# EAGLE design largemoteino1.1 (EAGLE 7.5.0)
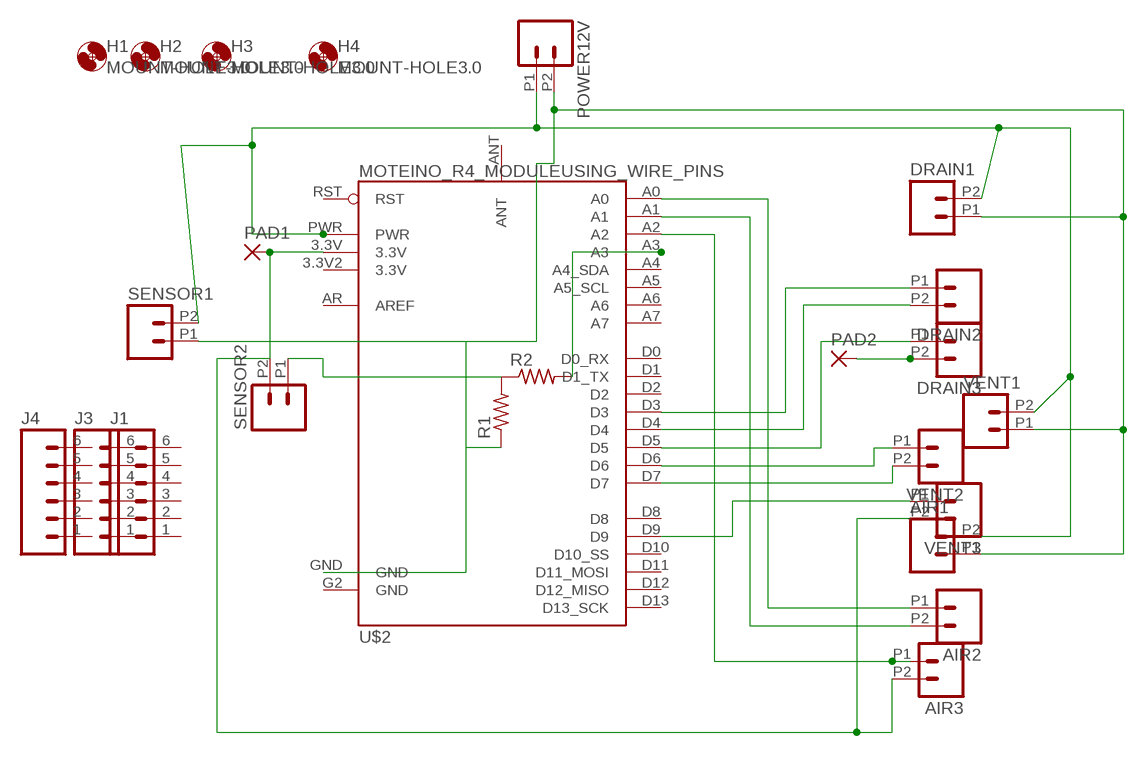
[diagram p0: schematic, sheet 1]

## Parts
AIR1  M022.54MM_SCREWTERM  [1X02_2.54_SCREWTERM]
AIR2  M022.54MM_SCREWTERM  [1X02_2.54_SCREWTERM]
AIR3  M022.54MM_SCREWTERM  [1X02_2.54_SCREWTERM]
DRAIN1  M022.54MM_SCREWTERM  [1X02_2.54_SCREWTERM]
DRAIN2  M022.54MM_SCREWTERM  [1X02_2.54_SCREWTERM]
DRAIN3  M022.54MM_SCREWTERM  [1X02_2.54_SCREWTERM]
H1  MOUNT-HOLE3.0  [3,0]
H2  MOUNT-HOLE3.0  [3,0]
H3  MOUNT-HOLE3.0  [3,0]
H4  MOUNT-HOLE3.0  [3,0]
J1  M06LOCK_LONGPADS  [1X06_LOCK_LONGPADS]
J3  M06LOCK_LONGPADS  [1X06_LOCK_LONGPADS]
J4  M06LOCK_LONGPADS  [1X06_LOCK_LONGPADS]
PAD1  2,15/1,0  [2,15/1,0]
PAD2  2,15/1,0  [2,15/1,0]
POWER12V  M022.54MM_SCREWTERM  [1X02_2.54_SCREWTERM]
R1  R-US_0207/10  [0207/10]
R2  R-US_0207/10  [0207/10]
SENSOR1  M022.54MM_SCREWTERM  [1X02_2.54_SCREWTERM]
SENSOR2  M022.54MM_SCREWTERM  [1X02_2.54_SCREWTERM]
U$2  MOTEINO_R4_MODULEUSING_WIRE_PINS  [MOTEINO_R4_WIRE]
VENT1  M022.54MM_SCREWTERM  [1X02_2.54_SCREWTERM]
VENT2  M022.54MM_SCREWTERM  [1X02_2.54_SCREWTERM]
VENT3  M022.54MM_SCREWTERM  [1X02_2.54_SCREWTERM]

## Nets
GND: AIR1.P1 DRAIN1.P1 POWER12V.P2 R1.1 SENSOR1.P1 U$2.GND VENT1.P1
N$1: AIR1.P2 DRAIN1.P2 POWER12V.P1 SENSOR1.P2 U$2.PWR VENT1.P2
N$2: DRAIN2.P1 U$2.D3
N$3: DRAIN2.P2 U$2.D4
N$4: DRAIN3.P1 U$2.D5
N$5: U$2.D6 VENT2.P1
N$6: R1.2 R2.1 SENSOR2.P1
N$7: U$2.D7 VENT2.P2
N$8: U$2.D9 VENT3.P1
N$9: AIR2.P1 U$2.A0
N$10: AIR2.P2 U$2.A1
N$11: AIR3.P1 U$2.A2
N$12: DRAIN3.P2 PAD2.1(P)
N$13: AIR3.P2 PAD1.1(P) SENSOR2.P2 U$2.3.3V VENT3.P2
N$15: R2.2 U$2.A3
Unconnected: J1.1 J1.2 J1.3 J1.4 J1.5 J1.6 J3.1 J3.2 J3.3 J3.4 J3.5 J3.6 J4.1 J4.2 J4.3 J4.4 J4.5 J4.6 U$2.3.3V2(3.3V) U$2.A4(A4_SDA) U$2.A5(A5_SCL) U$2.A6 U$2.A7 U$2.ANT U$2.AR(AREF) U$2.D0(D0_RX) U$2.D1(D1_TX) U$2.D2 U$2.D8 U$2.D10(D10_SS) U$2.D11(D11_MOSI) U$2.D12(D12_MISO) U$2.D13(D13_SCK) U$2.RST

## Power pins joined to a net without a drawn wire
GND: U$2.G2(GND)

## Library data of the parts
AIR1-AIR3 DRAIN1-DRAIN3 POWER12V SENSOR1 SENSOR2 VENT1-VENT3 = SparkFun-Connectors:M02: Standard 2-pin 0.1" header. Use with - straight break away headers ( PRT-00116) - right angle break away headers (PRT-00553) - swiss pins (PRT-00743) - machine pins (PRT-00117) - female headers (PRT-00115) Molex polarized connector foot print use with: PRT-08233 with associated crimp pins and housings. 2.54_SCREWTERM for use with PRT-10571. 3.5mm Screw Terminal footprints for PRT-08084 5mm Screw Terminal footprints for use with PRT-08432
H1-H4 = holes:MOUNT-HOLE: MOUNTING HOLE with drill center marker
J1 J3 J4 = SparkFun-Connectors:M06: Header 6 Standard 6-pin 0.1" header. Use with straight break away headers (SKU : PRT-00116), right angle break away headers (PRT-00553), swiss pins (PRT-00743), machine pins (PRT-00117), and female headers (PRT-00115). Molex polarized connector foot print use with SKU : PRT-08094 with associated crimp pins and housings. NOTES ON THE VARIANTS LOCK and LOCK_LONGPADS... This footprint was designed to help hold the alignment of a through-hole component (i.e. 6-pin header) while soldering it into place. You may notice that each hole has been shifted either up or down by 0.005 of an inch from it's more standard position (which is a perfectly straight line). This slight alteration caused the pins (the squares in the middle) to touch the edges of the holes. Because they are alternating, it causes a "brace" to hold the component in place. 0.005 has proven to be the perfect amount of "off-center" position when using our standard breakaway headers. Although looks a little odd when you look at the bare footprint, once you have a header in there, the alteration is very hard to notice. Also,if you push a header all the way into place, it is covered up entirely on the bottom side. This idea of altering the position of holes to aid alignment will be further integrated into the Sparkfun Library for other footprints. It can help hold any component with 3 or more connection pins.
PAD1 PAD2 = wirepad:2,15/1,0: THROUGH-HOLE PAD
R1 R2 = resistor:R-US_: RESISTOR, American symbol
U$2 = MoteinoR4Mod:MOTEINO_R4_MODULE: Moteino Module as a device. Available in two footprints, one with pads for 0.025" sq pins, and one using wire pins.

## Board
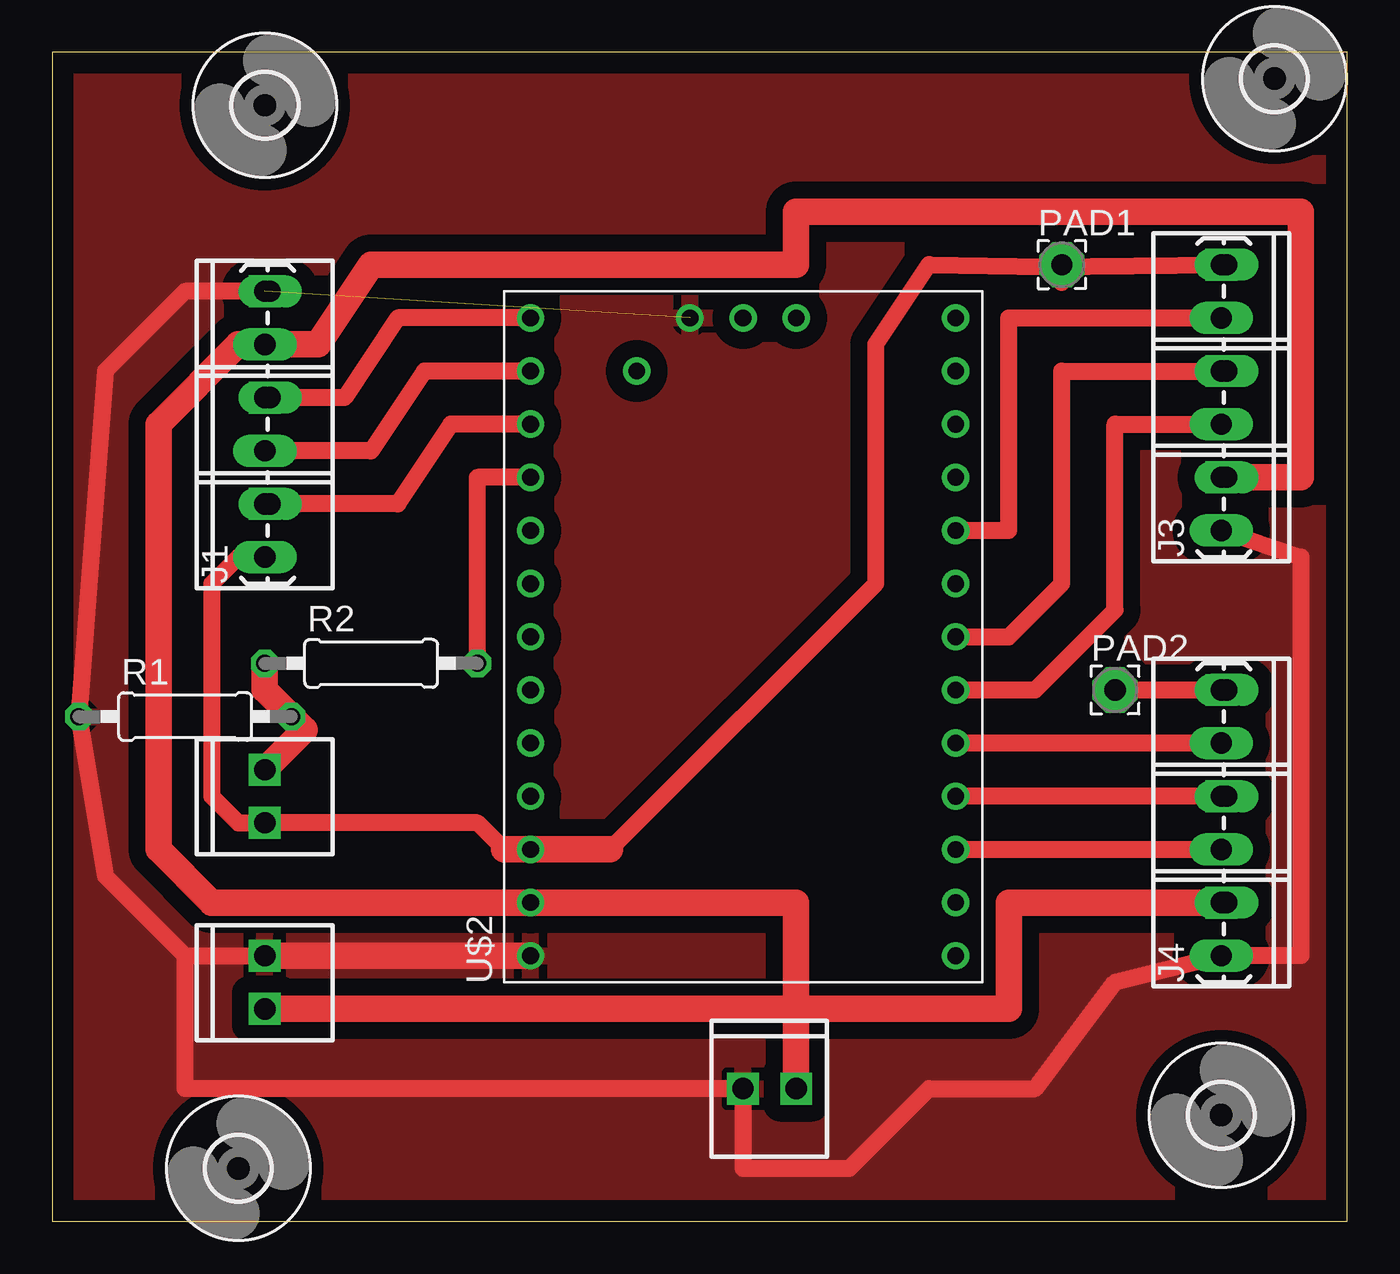
[diagram p1: board, top side]

Size 61.9 x 55.87 mm. Coordinates in mm from the lower left corner, seen from the top.
Outline: 0,0 61.9,0 61.9,55.87 0,55.87 0,0
Copper layers (1*16): Top 0.035mm / dielectric 1.5mm / Bottom 0.035mm
Design rules "default *": minimum track width 10mil, minimum drill 24mil, track to track 32mil, track to pad 32mil, pad to pad 32mil, via to via 32mil, smd to smd 8mil, copper to edge 40mil, drill to drill 8mil, minimum pad ring 10mil, minimum via ring 8mil, stop-mask expansion 4mil, vias tented up to drill 0mil, thermal gap 10mil

### Footprints (pad centres in the part's own frame; a part is rotated, then mirrored left to right if it is on the bottom)
1X02_2.54_SCREWTERM = drill 1.016 square: P1 2.54,0; P2 0,0
3,0 = hole 3: 0,0
1X06_LOCK_LONGPADS = drill 1.016 long: 1 0,0; 2 2.54,-0.254; 3 5.08,0; 4 7.62,-0.254; 5 10.16,0; 6 12.7,-0.254
2,15/1,0 = drill 1.016 pad 2.159 octagon: 1 0,0
0207/10 = drill 0.813 octagon: 1 -5.08,0; 2 5.08,0
MOTEINO_R4_WIRE = drill 0.8: 3.3V -10.16,8.89; 3.3V2 15.24,-1.27; A0 15.24,8.89; A1 12.7,8.89; A2 10.16,8.89; A3 7.62,8.89; A4 5.08,8.89; A5 2.54,8.89; A6 0,8.89; A7 -2.54,8.89; ANT 12.7,3.81; AR 15.24,-3.81; D0 -5.08,8.89; D1 -7.62,8.89; D2 -12.7,-11.43; D3 -10.16,-11.43; D4 -7.62,-11.43; D5 -5.08,-11.43; D6 -2.54,-11.43; D7 0,-11.43; D8 2.54,-11.43; D9 5.08,-11.43; D10 7.62,-11.43; D11 10.16,-11.43; D12 12.7,-11.43; D13 15.24,-11.43; G2 15.24,1.27; GND -15.24,8.89; PWR -12.7,8.89; RST -15.24,-11.43

### Placement (x,y rotation side)
AIR1  10.16,41.91 90 top
AIR2  10.16,36.83 90 top
AIR3  10.16,31.75 90 top
DRAIN1  55.88,15.24 270 top
DRAIN2  55.88,20.32 270 top
DRAIN3  55.88,25.4 270 top
H1  8.89,2.54 0 top
H2  55.88,5.08 0 top
H3  58.42,54.61 0 top
H4  10.16,53.34 0 top
J1  10.16,31.75 90 top
J3  55.88,33.02 90 top
J4  55.88,12.7 90 top
PAD1  48.26,45.72 0 top
PAD2  50.8,25.4 0 top
POWER12V  33.02,6.35 0 top
R1  6.35,24.13 0 top
R2  15.24,26.67 0 top
SENSOR1  10.16,10.16 90 top
SENSOR2  10.16,19.05 90 top
U$2  31.75,27.94 90 top
VENT1  55.88,35.56 270 top
VENT2  55.88,40.64 270 top
VENT3  55.88,45.72 270 top

### Tracks (layer width: path | path; a pad name or v marks a point on that pad's centre or on a via)
GND  (1 unrouted)
  Top 0.813: 6.35,12.7 6.35,6.35 POWER12V.P2 33.02,2.54 38.1,2.54 41.91,6.35 46.99,6.35 50.8,11.43 DRAIN1.P1 59.69,12.7 59.69,31.75 VENT1.P1 | 6.35,12.7 SENSOR1.P1 | AIR1.P1 6.35,44.45 2.54,40.64 R1.1 2.54,16.51 6.35,12.7
  Top 1.27: SENSOR1.P1 U$2.GND
  pour Top: 0,55.88 62.23,55.88 62.23,0 0,0
N$1
  Top 1.27: POWER12V.P1 35.56,10.16 | 35.56,10.16 35.56,15.24 U$2.PWR 7.62,15.24 5.08,17.78 5.08,38.1 8.89,41.91 AIR1.P2 12.7,41.91 15.24,45.72 35.56,45.72 35.56,48.26 59.69,48.26 59.69,35.56 VENT1.P2 | SENSOR1.P2 35.56,10.16 | DRAIN1.P2 45.72,15.24 45.72,10.16 35.56,10.16
N$2
  Top 0.813: U$2.D3 DRAIN2.P1
N$3
  Top 0.813: DRAIN2.P2 U$2.D4
N$4
  Top 0.813: DRAIN3.P1 U$2.D5
N$5
  Top 0.813: VENT2.P1 50.8,38.1 50.8,29.21 46.99,25.4 U$2.D6
N$6
  Top 1.27: SENSOR2.P1 12.06,23.49 R1.2 10.16,25.4 R2.1
N$7
  Top 0.813: VENT2.P2 48.26,40.64 48.26,30.48 45.72,27.94 U$2.D7
N$8
  Top 0.813: VENT3.P1 45.72,43.18 45.72,33.02 U$2.D9
N$9
  Top 0.813: AIR2.P1 13.97,39.37 16.51,43.18 U$2.A0
N$10
  Top 0.813: AIR2.P2 15.24,36.83 17.78,40.64 U$2.A1
N$11
  Top 0.813: AIR3.P1 16.51,34.29 19.05,38.1 U$2.A2
N$12
  Top 0.813: PAD2.1 DRAIN3.P2
N$13
  Top 0.813: 21.59,17.78 20.32,19.05 SENSOR2.P2 8.89,19.05 7.62,20.32 7.62,30.48 8.89,31.75 AIR3.P2 | 26.67,17.78 39.37,30.48 39.37,41.91 41.91,45.72 47.51,45.63 | 47.51,45.63 VENT3.P2 | PAD1.1 48.26,44.88 47.51,45.63
  Top 1.27: 21.59,17.78 U$2.3.3V 26.67,17.78
N$15
  Top 0.813: R2.2 20.32,35.56 U$2.A3